# EAGLE design remote (EAGLE 7.0.0)
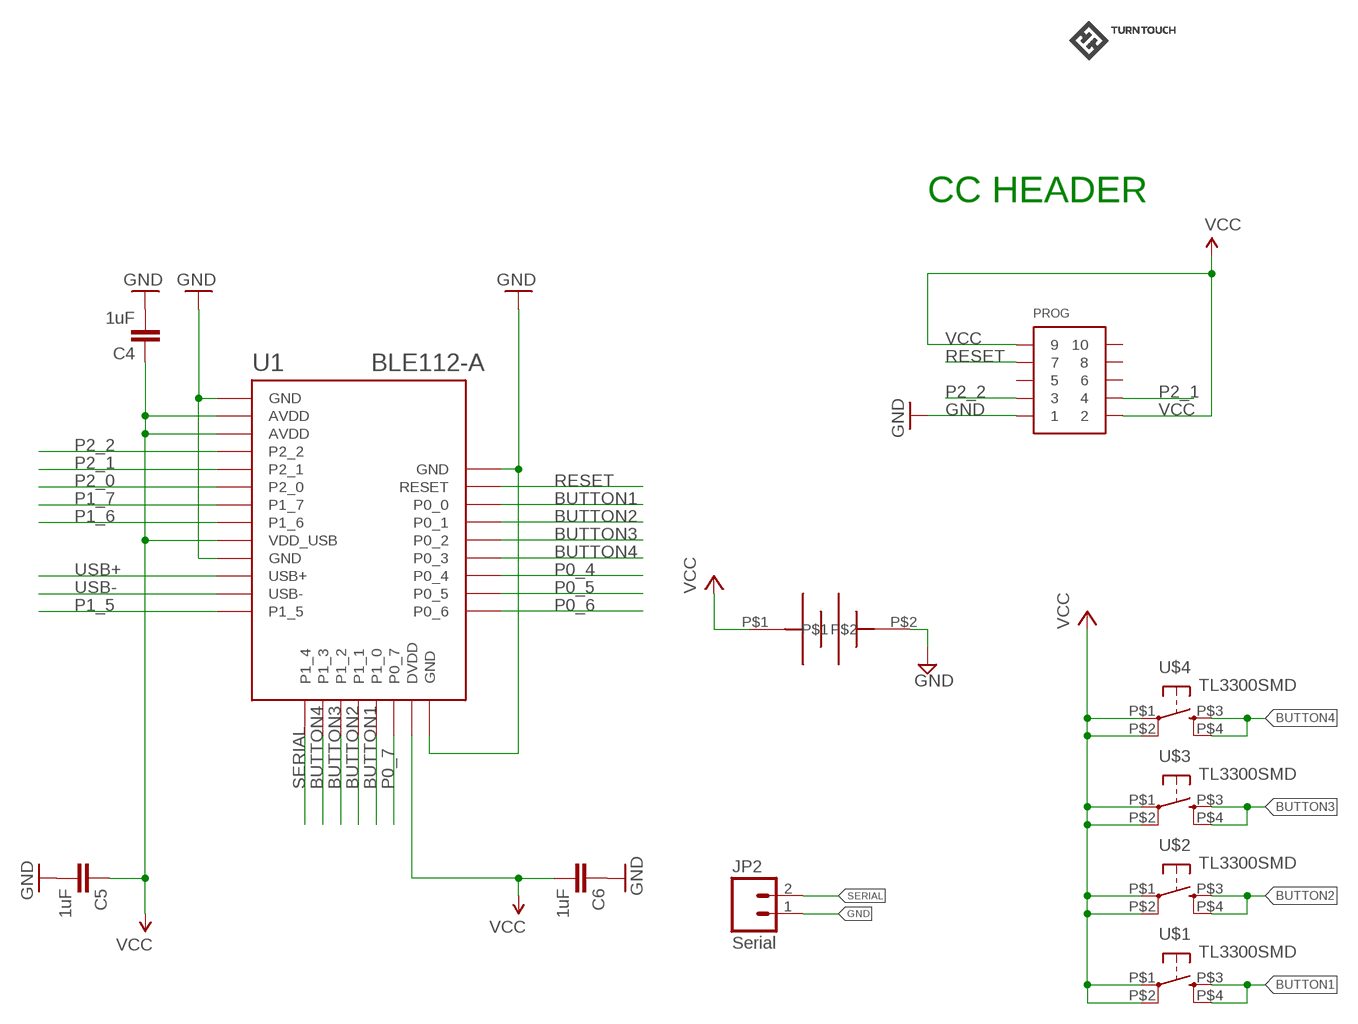
[diagram p0: schematic, sheet 1]

## Parts
C4  1uF  CAP0603-CAP  [0603-CAP]
C5  1uF  CAP0603-CAP  [0603-CAP]
C6  1uF  CAP0603-CAP  [0603-CAP]
JP2  Serial  M02PTH  [1X02]
LOGO  TURNTOUCHLOGO200DPI  [LOGO]
PROG  CONN_5-2-FTSH-V  [FTSH-105-DV]
U1  BLE112-A  BLE112-A-VISUAL  [BLE112-A]
U$1  TL3300SMD  [TL3300]
U$2  TL3300SMD  [TL3300]
U$3  TL3300SMD  [TL3300]
U$4  TL3300SMD  [TL3300]
U$6  COINCELLHOLDER  [20MMCOINCELL]

## Nets
BUTTON1: U1.P0_0 U1.P1_0 U$1.P$3(S) U$1.P$4(S1)
BUTTON2: U1.P0_1 U1.P1_1 U$2.P$3(S) U$2.P$4(S1)
BUTTON3: U1.P0_2 U1.P1_2 U$3.P$3(S) U$3.P$4(S1)
BUTTON4: U1.P0_3 U1.P1_3 U$4.P$3(S) U$4.P$4(S1)
GND: C4.2 C5.2 C6.1 JP2.1 PROG.1 U1.GND1(GND) U1.GND2(GND) U1.GND3(GND) U1.GND4(GND) U$6.P$2
P0_4: U1.P0_4
P0_5: U1.P0_5
P0_6: U1.P0_6
P0_7: U1.P0_7
P1_5: U1.P1_5
P1_6: U1.P1_6
P1_7: U1.P1_7
P2_0: U1.P2_0
P2_1: PROG.4 U1.P2_1
P2_2: PROG.3 U1.P2_2
RESET: PROG.7 U1.RESET
SERIAL: JP2.2 U1.P1_4
USB+: U1.USB+
USB-: U1.USB-
VCC [power]: C4.1 C5.1 C6.2 PROG.2 PROG.9 U1.AVDD1(AVDD) U1.AVDD2(AVDD) U1.DVDD U1.VDD_USB U$1.P$1(P) U$1.P$2(P1) U$2.P$1(P) U$2.P$2(P1) U$3.P$1(P) U$3.P$2(P1) U$4.P$1(P) U$4.P$2(P1) U$6.P$1
Unconnected: PROG.5 PROG.6 PROG.8 PROG.10

## Notes on the sheet
- CC HEADER

## Library data of the parts
C4-C6 = SparkFun:CAP: Capacitor Standard 0603 ceramic capacitor, and 0.1" leaded capacitor.
JP2 = SparkFun-Connectors:M02: Standard 2-pin 0.1" header. Use with - straight break away headers ( PRT-00116) - right angle break away headers (PRT-00553) - swiss pins (PRT-00743) - machine pins (PRT-00117) - female headers (PRT-00115) Molex polarized connector foot print use with: PRT-08233 with associated crimp pins and housings. 2.54_SCREWTERM for use with PRT-10571. 3.5mm Screw Terminal footprints for PRT-08084 5mm Screw Terminal footprints for use with PRT-08433
LOGO = remote:TURNTOUCHLOGO
PROG = pel_misc:CONN_5-2
U1 = sf-bluegiga:BLE112-A-VISUAL: Bluetooth Low Energy single-mode module - Bluetooth 4.0, chip antenna
U$1-U$4 = remote:TL3300
U$6 = remote:COINCELLHOLDER

## Net classes
0 default: width 0.152 mm, drill 0.33 mm, clearance 0.152 mm
1 power: width 0.254 mm, drill 0.33 mm, clearance 0.152 mm

## Board
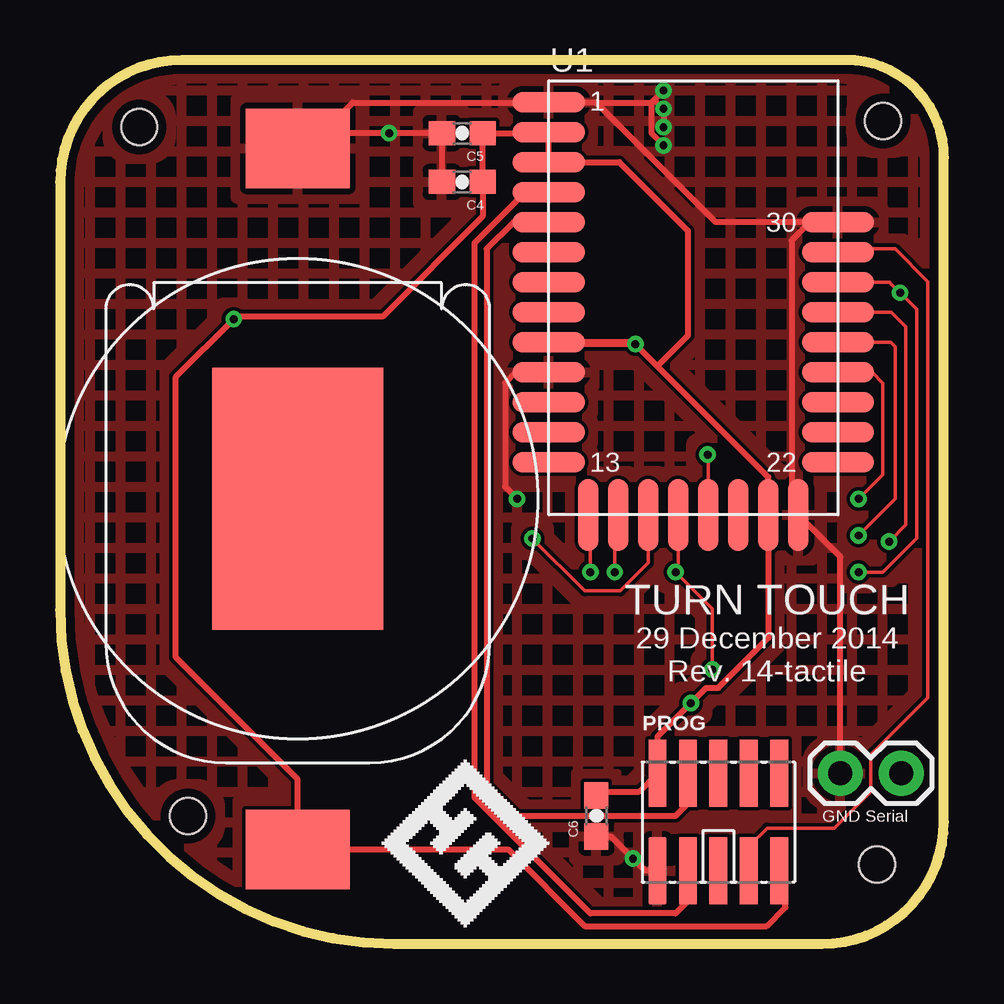
[diagram p1: board, top side]
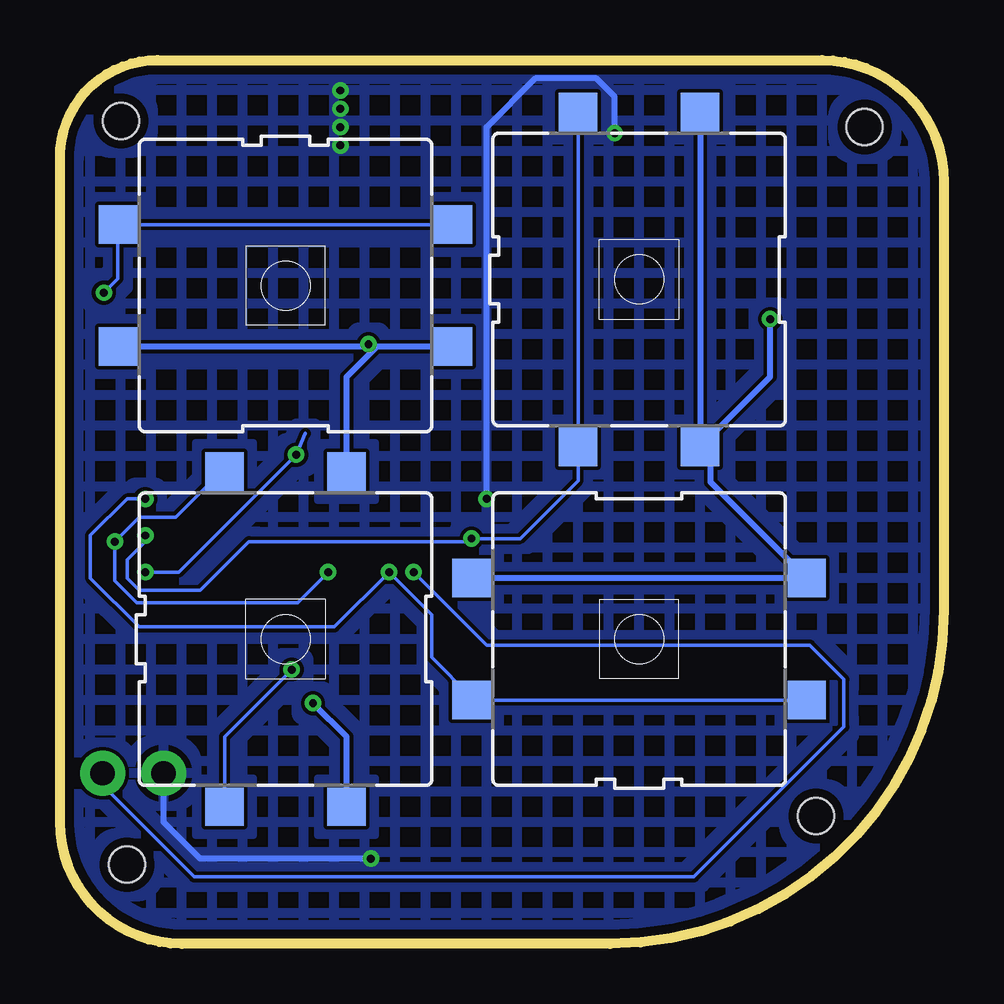
[diagram p2: board, bottom side, seen from below]

Size 36.83 x 36.83 mm. Coordinates in mm from the lower left corner, seen from the top.
Outline: 0,31.75 0,13.92 arc90 13.92,0 31.75,0 arc90 36.83,5.08 36.83,32.77 arc90 32.77,36.83 5.08,36.83 arc90 0,31.75
Copper layers (1*16): Top 0.0356mm / dielectric 1.5011mm / Bottom 0.0356mm
Design rules "OSHPark *": minimum track width 6mil, minimum drill 13mil, track to track 6mil, track to pad 6mil, pad to pad 6mil, via to via 6mil, smd to smd 6mil, copper to edge 15mil, drill to drill 6mil, minimum pad ring 7mil, minimum via ring 7mil, stop-mask expansion 3mil, vias tented up to drill 0mil, thermal gap 10mil
Holes 1.5 mm at 3.3,34.04 34.04,3.3 34.29,34.29 5.33,5.33

### Footprints (pad centres in the part's own frame; a part is rotated, then mirrored left to right if it is on the bottom)
0603-CAP = smd 1.1 x 1: 1 -0.85,0; 2 0.85,0
1X02 = drill 1.016 pad 1.88: 1 0,0; 2 2.54,0
FTSH-105-DV = smd 0.74 x 2.8: 1 -2.54,-2.03; 2 -2.54,2.03; 3 -1.27,-2.03; 4 -1.27,2.03; 5 0,-2.03; 6 0,2.03; 7 1.27,-2.03; 8 1.27,2.03; 9 2.54,-2.03; 10 2.54,2.03
BLE112-A = smd 3 x 0.85: AVDD1 -6.05,6.9; AVDD2 -6.05,5.65; GND1 -6.05,8.15; GND2 -6.05,-3.1; GND4 6,3.15; P0_0 6,0.65; P0_1 6,-0.6; P0_2 6,-1.85; P0_3 6,-3.1; P0_4 6,-4.35; P0_5 6,-5.6; P0_6 6,-6.85; P1_5 -6.05,-6.85; P1_6 -6.05,-0.6; P1_7 -6.05,0.65; P2_0 -6.05,1.9; P2_1 -6.05,3.15; P2_2 -6.05,4.4; RESET 6,1.9; USB+ -6.05,-4.35; USB- -6.05,-5.6; VDD_USB -6.05,-1.85 | smd 0.85 x 3: DVDD 3.1,-9.05; GND3 4.35,-9.05; P0_7 1.85,-9.05; P1_0 0.6,-9.05; P1_1 -0.65,-9.05; P1_2 -1.9,-9.05; P1_3 -3.15,-9.05; P1_4 -4.4,-9.05
TL3300 = smd 1.6 x 1.6: P$1 -6.985,2.54; P$2 6.985,2.54; P$3 -6.985,-2.54; P$4 6.985,-2.54
20MMCOINCELL = smd 4.318 x 3.302: P$1 0,14.605; P$2 0,-14.605 | smd 7.112 x 10.922: P$3 0,0

### Placement (x,y rotation side)
C4  16.76,31.75 180 top
C5  16.76,33.78 180 top
C6  22.35,5.33 90 top
JP2  32.51,7.11 0 top
LOGO  13.46,0.76 0 top
PROG  27.43,5.08 0 top
U1  26.42,26.92 0 top
U$1  27.43,27.43 180 bottom
U$2  27.43,12.7 270 bottom
U$3  12.7,27.69 270 bottom
U$4  12.7,12.7 0 bottom
U$6  9.91,18.54 180 top

### Tracks (layer width: path | path; a pad name or v marks a point on that pad's centre or on a via)
BUTTON1  (via drill 0.33)
  Top 0.152: U1.P0_0 34.56,27.57 34.62,27.51 v35.01,27.13 35.69,26.44 35.69,16.9 34.29,15.49 v33.27,15.49 | U1.P1_0 27.02,19.9 v26.99,20.38
  Bottom 0.152: v33.27,15.49 31.88,15.49 v26.99,20.38 26.61,21.27 | U$1.P$3 U$1.P$4 34.42,27.72 v35.01,27.13
BUTTON2  (via drill 0.33)
  Top 0.152: U1.P0_1 34.64,26.32 35.24,25.72 35.24,17.46 v34.54,16.76 | U1.P1_1 25.77,15.86 v25.65,15.49 27.18,13.97 v27.18,11.43
  Bottom 0.152: v25.65,15.49 26.92,14.22 33.63,14.22 34.54,15.14 v34.54,16.76 33.53,17.78 32,17.78 30.1,19.68 U$2.P$3 | U$2.P$4 29.97,8.64 v27.18,11.43
BUTTON3  (via drill 0.33)
  Top 0.152: U1.P0_2 34.62,25.07 34.8,24.89 34.8,18.54 v33.27,17.02 | U1.P1_2 24.52,15.88 23.35,14.71 21.86,14.71 v19.68,16.89
  Bottom 0.152: v33.27,17.02 33.27,16.76 34.04,16 34.04,15.24 33.53,14.73 30.99,14.73 28.96,16.76 19.81,16.76 v19.68,16.89 17.65,16.89 15.24,19.3 U$3.P$4 U$3.P$3
BUTTON4  (via drill 0.33)
  Top 0.152: v23.11,15.49 23.11,17.72 U1.P1_3 | U1.P0_3 33.83,23.82 34.29,23.37 34.29,19.56 v33.27,18.54
  Bottom 0.152: U$4.P$4 U$4.P$3 19.68,10.29 21.34,11.94 21.34,13.72 v23.11,15.49 25.4,13.21 33.53,13.21 35.56,15.24 35.56,17.02 34.04,18.54 v33.27,18.54
GND  (via drill 0.33)
  Top 0.152: 10.54,33.78 U$6.P$2
  Top 0.254: U$6.P$2 10.29,33.15 12.19,35.05 20.85,35.05 U1.GND1 20.9,35.05 22.35,35.05 | PROG.1 24.38,3.05 v23.88,3.56 22.95,4.48 C6.1 | JP2.1 32.51,16.13 U1.GND3 30.48,18.16 30.48,29.31 31.24,30.07 | C4.2 C5.2 v13.72,33.78 10.54,33.78 | U1.GND4 31.24,30.07 | 31.24,30.07 27.33,30.07 22.35,35.05 | U1.GND2 19,23.82 18.54,23.37 18.54,19.05 v19.05,18.54 | 22.35,35.05 24.64,35.05 | 24.64,35.05 24.77,35.18 | 24.77,35.18 v25.15,35.56 | 24.64,35.05 24.64,33.78 v25.15,33.27 | 25.15,34.29 v25.15,34.04 v25.15,34.8 24.77,35.18
  Bottom 0.254: v23.88,3.56 30.99,3.56 32.51,5.08 JP2.1 | v19.05,18.54 19.05,34.04 17.02,36.07 14.48,36.07 13.72,35.31 v13.72,33.78 13.97,33.78
  pour Bottom (hatched): -1.02,-0.76 37.59,-0.76 37.59,37.85 -1.02,37.85
  pour Top (hatched): -1.78,38.61 38.35,38.61 38.35,-1.52 -1.78,-1.52
P2_1
  Top 0.254: U1.P2_1 18.9,30.07 17.78,28.96 17.78,6.6 19.05,5.33 25.65,5.33 26.16,5.84 PROG.4
P2_2
  Top 0.254: PROG.3 26.16,1.78 25.65,1.27 22.1,1.27 17.27,6.1 17.27,29.21 19.3,31.24 20.79,31.24 U1.P2_2
RESET
  Top 0.152: PROG.7 28.7,4.06 29.46,4.83 32.26,4.83 33.78,6.35 33.78,7.87 36.16,10.26 36.16,27.59 34.8,28.96 33.06,28.96 U1.RESET
SERIAL  (via drill 0.33)
  Top 0.152: v22.1,15.49 22.1,17.79 U1.P1_4
  Bottom 0.152: JP2.2 35.05,6.6 31.24,2.79 10.41,2.79 4.17,9.04 4.17,11.03 5.59,12.45 19.05,12.45 v22.1,15.49
VCC  (via drill 0.33)
  Top 0.254: U$6.P$1 18.67,3.94 21.86,0.74 29.44,0.74 30.23,1.52 30.23,2.8 PROG.9 | 24.89,24.08 29.52,19.45 U1.DVDD 29.52,12.75 27.43,10.67 26.92,10.67 v26.29,10.03 24.89,8.64 PROG.2 24.13,6.35 22.61,6.35 22.44,6.18 C6.2 | U$6.P$1 9.91,6.86 4.83,11.94 4.83,23.62 v7.24,26.04 7.37,26.16 13.46,26.16 17.61,30.31 C4.1 C5.1 20.83,33.78 U1.AVDD1 U1.AVDD2 23.31,32.57 26.16,29.72 26.16,25.35 24.89,24.08 | 10.67,4.7 U$6.P$1 | 24.89,24.08 v23.98,24.99 | v23.98,24.99 23.9,25.07 U1.VDD_USB 20.45,24.99 v23.98,24.99
  Bottom 0.254: 23.62,24.89 U$1.P$1 23.88,24.89 v23.98,24.99 | 23.62,24.89 U$1.P$2 | U$2.P$1 24.89,23.62 23.62,24.89 | U$3.P$1 U$3.P$2 9.72,21.14 | U$4.P$1 U$4.P$2 9.72,19.24 9.72,21.14 | 9.72,21.14 7.24,23.62 v7.24,26.04 | U$2.P$2 24.89,8.64 v26.29,10.03

### Text on the board
tNames: TURN TOUCH | 29 December 2014 / Rev. 14-tactile | GND Serial